# EAGLE schematic TypeCConverter (EAGLE 9.0.0)
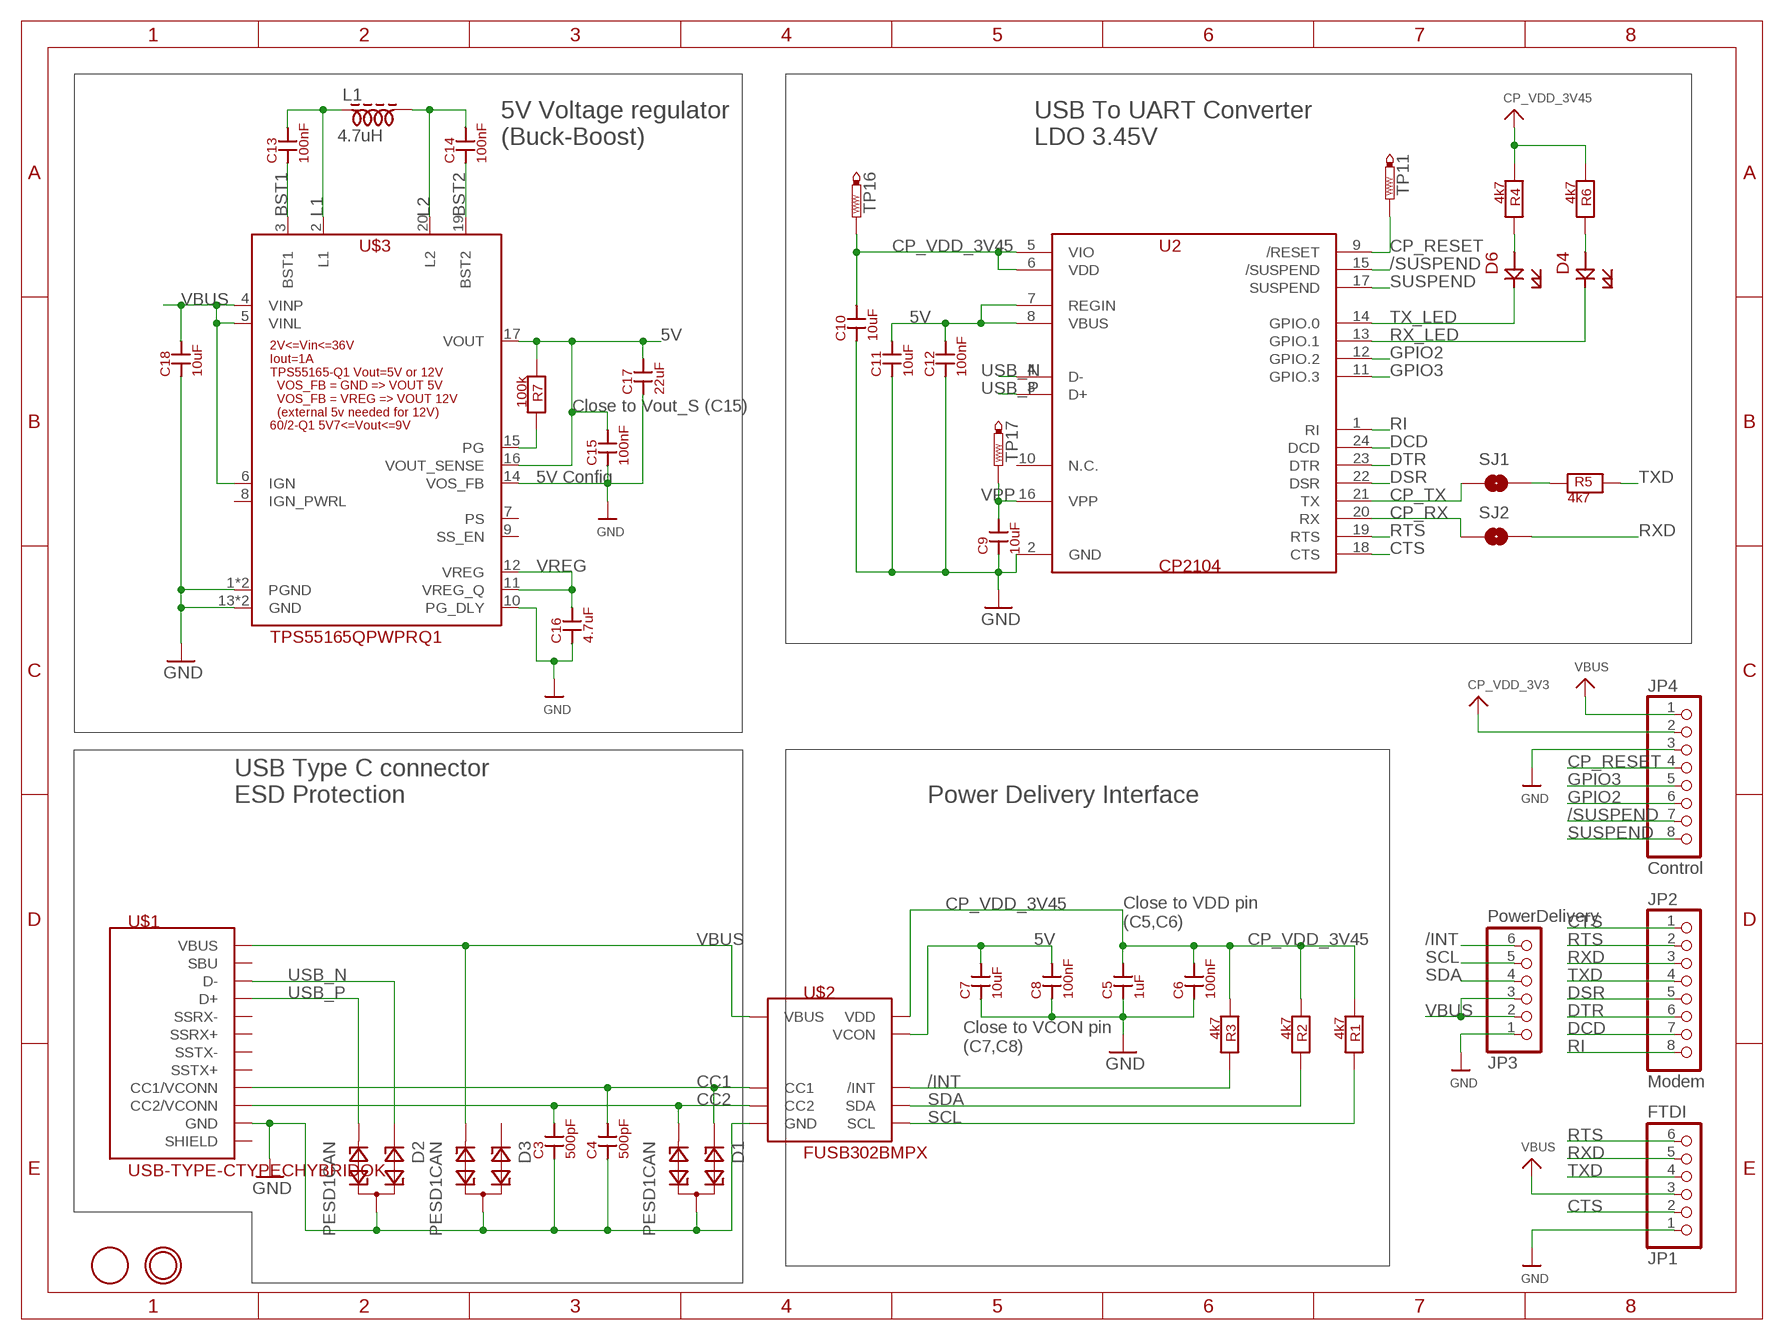
[diagram p0: schematic, sheet 1]

## Parts
C3  500pF  C  [C0402K]
C4  500pF  C  [C0402K]
C5  1uF  C  [C0402K]
C6  100nF  C  [C0402K]
C7  10uF  C  [C0402K]
C8  100nF  C  [C0402K]
C9  10uF  C  [C0402K]
C10  10uF  C  [C0402K]
C11  10uF  C  [C0402K]
C12  100nF  C  [C0402K]
C13  100nF  C  [C0402K]
C14  100nF  C  [C0402K]
C15  100nF  C  [C0402K]
C16  4.7uF  C  [C0402K]
C17  22uF  C  [C0402K]
C18  10uF  C  [C0402K]
D1  PESD1CAN  [SOT23]
D2  PESD1CAN  [SOT23]
D3  PESD1CAN  [SOT23]
D4  LED  [CHIP-LED0805]
D6  LED  [CHIP-LED0805]
JP1  FTDI  HEADER-1X676MIL  [1X06_ROUND_76]
JP2  Modem  HEADER-1X870MIL  [1X08_ROUND_70]
JP3  PowerDelivery  HEADER-1X676MIL  [1X06_ROUND_76]
JP4  Control  HEADER-1X870MIL  [1X08_ROUND_70]
L1  4.7uH  INDUCTOR  [DFN600X600X420-2]
R1  4k7  RESISTOR  [R0402]
R2  4k7  RESISTOR  [R0402]
R3  4k7  RESISTOR  [R0402]
R4  4k7  RESISTOR  [R0402]
R5  4k7  RESISTOR  [R0402]
R6  4k7  RESISTOR  [R0402]
R7  100k  RESISTOR  [R0402]
SJ1  SOLDERJUMPER-OLDTRACE  [SJ_2S-TRACE]
SJ2  SOLDERJUMPER-OLDTRACE  [SJ_2S-TRACE]
TP2  FIDUCIAL  [FIDUCIAL_1MM]
TP11  CP_RESET  PTR1B1,27  [B1,27]
TP16  CP_RESET  PTR1B1,27  [B1,27]
TP17  VPP  PTR1B1,27  [B1,27]
U2  CP2104  [QFN50P400X400X100-24]
U$1  USB-TYPE-CTYPECHYBRIDOK  [USBTYPECHYBRIDOK]
U$2  FUSB302BMPX  [QFN50P250X250X80-15T150]
U$3  TPS55165QPWPRQ1  [SOP65P640X120-21N]
U$19  MOUNTINGHOLE2.0  [MOUNTINGHOLE_2.0_PLATED]

## Nets
5V: C7.2(__) C8.2(__) C11.2(__) C12.2(__) C15.2(__) C17.2(__) R7.1(_) U2.7(REGIN) U2.8(VBUS) U$2.12(VCON) U$2.13(VCON) U$3.16(VOUT_SENSE) U$3.17(VOUT)
/INT: JP3.6 R3.2(__) U$2.5(/INT)
/SUSPEND: JP4.7 U2.15(/SUSPEND)
BST1: C13.1(_) U$3.3(BST1)
BST2: C14.1(_) U$3.19(BST2)
CC1: C4.2(__) D1.1 U$1.A5(CC1/VCONN) U$2.10(CC1) U$2.11(CC1)
CC2: C3.2(__) D1.2 U$1.B5(CC2/VCONN) U$2.1(CC2) U$2.14(CC2)
CP_RESET: JP4.4 TP11.TP U2.9(/RESET)
CP_RX: SJ2.1 U2.20(RX)
CP_TX: SJ1.1 U2.21(TX)
CP_VDD_3V45: C5.2(__) C6.2(__) C10.2(__) JP4.2 R1.1(_) R2.1(_) R3.1(_) R4.1(_) R6.1(_) TP16.TP U2.5(VIO) U2.6(VDD) U$2.3(VDD) U$2.4(VDD) ; supply symbol labelled CP_VDD_3V3
CTS: JP1.2 JP2.1 U2.18(CTS)
DCD: JP2.7 U2.24(DCD)
DSR: JP2.5 U2.22(DSR)
DTR: JP2.6 U2.23(DTR)
GND: C3.1(_) C4.1(_) C5.1(_) C6.1(_) C7.1(_) C8.1(_) C9.1(_) C10.1(_) C11.1(_) C12.1(_) C15.1(_) C16.1(_) C17.1(_) C18.1(_) D1.3 D2.3 D3.3 JP1.1 JP3.1 JP4.3 U2.2(GND) U$1.A1(GND) U$1.A12(GND) U$1.B1(GND) U$1.B12(GND) U$2.8(GND) U$2.9(GND) U$2.15(GND) U$3.1(PGND) U$3.10(PG_DLY) U$3.13(GND) U$3.14(VOS_FB) U$3.18(GND) U$3.21(PGND)
GPIO2: JP4.6 U2.12(GPIO.2)
GPIO3: JP4.5 U2.11(GPIO.3)
L1: C13.2(__) L1.1 U$3.2(L1)
L2: C14.2(__) L1.2 U$3.20(L2)
N$1: R5.1(_) SJ1.2
PG: R7.2(__) U$3.15(PG)
RI: JP2.8 U2.1(RI)
RTS: JP1.6 JP2.2 U2.19(RTS)
RX_LED: D4.C(__) U2.13(GPIO.1)
RXD: JP1.5 JP2.3 SJ2.2
RXLEDWP: D4.A(_) R6.2(__)
SCL: JP3.5 R1.2(__) U$2.6(SCL)
SDA: JP3.4 R2.2(__) U$2.7(SDA)
SUSPEND: JP4.8 U2.17(SUSPEND)
TX_LED: D6.C(__) U2.14(GPIO.0)
TXD: JP1.4 JP2.4 R5.2(__)
TXLEDWP: D6.A(_) R4.2(__)
USB_N: D2.1 U2.4(D-) U$1.A7(D-) U$1.B7(D-)
USB_P: D2.2 U2.3(D+) U$1.A6(D+) U$1.B6(D+)
VBUS: C18.2(__) D3.2 JP1.3 JP3.2 JP3.3 JP4.1 U$1.A4(VBUS) U$1.A9(VBUS) U$1.B4(VBUS) U$1.B9(VBUS) U$2.2(VBUS) U$3.4(VINP) U$3.5(VINL) U$3.6(IGN)
VPP: C9.2(__) TP17.TP U2.16(VPP)
VREG: C16.2(__) U$3.11(VREG_Q) U$3.12(VREG)
Unconnected: D3.1 U2.10(N.C.) U$1.1(SHIELD) U$1.2(SHIELD) U$1.3(SHIELD) U$1.4(SHIELD) U$1.A2(SSTX+) U$1.A3(SSTX-) U$1.A8(SBU) U$1.A10(SSRX-) U$1.A11(SSRX+) U$1.B2(SSTX+) U$1.B3(SSTX-) U$1.B8(SBU) U$1.B10(SSRX-) U$1.B11(SSRX+) U$3.7(PS) U$3.8(IGN_PWRL) U$3.9(SS_EN)

## Notes on the sheet
- 5V Voltage regulator
  (Buck-Boost)
- USB To UART Converter
  LDO 3.45V
- Close to Vout_S (C15)
- 5V Config
- USB Type C connector
  ESD Protection
- Power Delivery Interface
- Close to VDD pin
  (C5,C6)
- Close to VCON pin
  (C7,C8)

## Library data of the parts
C3-C18 = capacitor:C
D1-D3 = diode:PESD1CAN: CAN bus ESD protection diode Source: http://www.nxp.com/documents/data_sheet/PESD1CAN.pdf
D4 D6 = LED:LED
JP1 JP3 = microbuilder:HEADER-1X6: PIN HEADER
JP2 JP4 = microbuilder:HEADER-1X8: PIN HEADER
L1 = Inductor:INDUCTOR
R1-R7 = resistor:RESISTOR
SJ1 SJ2 = SparkFun-Retired:SOLDERJUMPER-OLD: Solder Jumper Standard SMD solder jumper. Used to automate production. Two varients : Normally Open and Normally Closed are the same, but have different paste layers. NC will have a large amount of paste and should jumper during reflow.
TP2 = adafruit:FIDUCIAL: For use by pick and place machines to calibrate the vision/machine, 1mm By microbuilder.eu
TP11 TP16 TP17 = testpad:PTR1: TEST PIN
U2 = CP2104:CP2104
U$1 = lio:USB-TYPE-C
U$2 = PDController:FUSB302BMPX
U$3 = TPS55165QPWPRQ1:TPS55165QPWPRQ1
U$19 = microbuilder:MOUNTINGHOLE: Mounting Hole For #2 screws (0.086"/2.18mm width, 0.094"/2.4mm hole) use 2.5mm; BOM: EXCLUDE